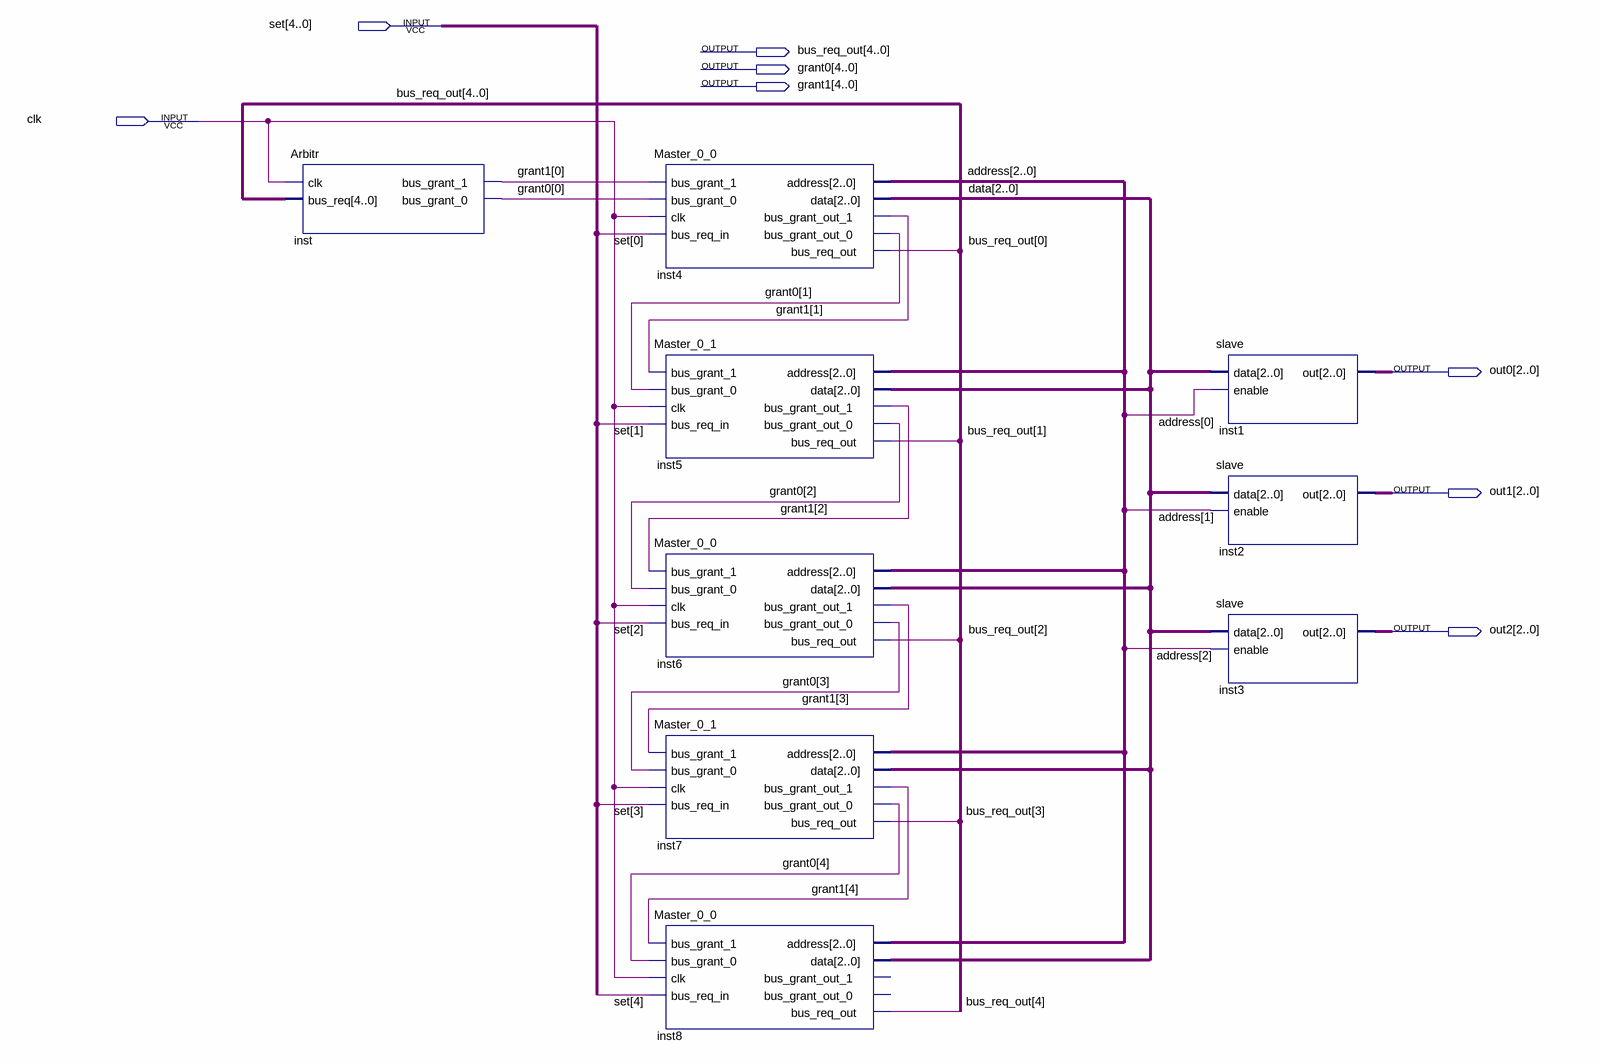
[diagram p0: schematic sheet]
// Quartus schematic lab5.bdf as structural Verilog: 9 symbols, 8 pins
module lab5 (
  input  [4:0] set,
  input  clk,
  output [4:0] bus_req_out,
  output [4:0] grant0,
  output [4:0] grant1,
  output [2:0] out0,
  output [2:0] out1,
  output [2:0] out2
);

  wire [2:0] address, data;

  Arbitr inst (.clk(clk), .bus_req(bus_req_out), .bus_grant_1(grant1[0]), .bus_grant_0(grant0[0]));
  Master_0_0 inst4 (
    .bus_grant_1(grant1[0]), .bus_grant_0(grant0[0]), .clk(clk), .bus_req_in(set[0]), .address(address),
    .data(data), .bus_grant_out_1(grant1[1]), .bus_grant_out_0(grant0[1]), .bus_req_out(bus_req_out[0]));
  Master_0_1 inst5 (
    .bus_grant_1(grant1[1]), .bus_grant_0(grant0[1]), .clk(clk), .bus_req_in(set[1]), .address(address),
    .data(data), .bus_grant_out_1(grant1[2]), .bus_grant_out_0(grant0[2]), .bus_req_out(bus_req_out[1]));
  Master_0_0 inst6 (
    .bus_grant_1(grant1[2]), .bus_grant_0(grant0[2]), .clk(clk), .bus_req_in(set[2]), .address(address),
    .data(data), .bus_grant_out_1(grant1[3]), .bus_grant_out_0(grant0[3]), .bus_req_out(bus_req_out[2]));
  Master_0_1 inst7 (
    .bus_grant_1(grant1[3]), .bus_grant_0(grant0[3]), .clk(clk), .bus_req_in(set[3]), .address(address),
    .data(data), .bus_grant_out_1(grant1[4]), .bus_grant_out_0(grant0[4]), .bus_req_out(bus_req_out[3]));
  Master_0_0 inst8 (
    .bus_grant_1(grant1[4]), .bus_grant_0(grant0[4]), .clk(clk), .bus_req_in(set[4]), .address(address),
    .data(data), .bus_req_out(bus_req_out[4]));  // open: bus_grant_out_1, bus_grant_out_0
  slave inst1 (.data(data), .enable(address[0]), .out(out0));
  slave inst2 (.data(data), .enable(address[1]), .out(out1));
  slave inst3 (.data(data), .enable(address[2]), .out(out2));
endmodule
